# Altium schematic sheet LCD_Board.SchDoc
size A; SheetNumber: 2; SheetTotal: 2
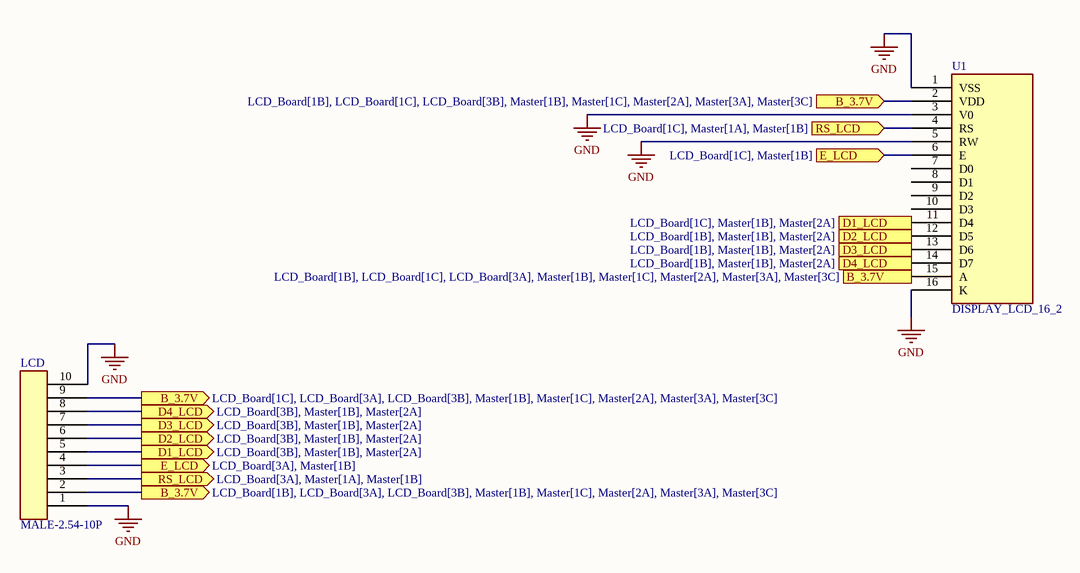
[diagram p0: LCD_Board.SchDoc]

## Parts
LCD  MALE-2.54-10P  [MALE-2.54-10P]
U1  DISPLAY_LCD_16_2  [DISPLAY_LCD_16_2]

## Ports
B_3.7V (in, see LCD_Board[1B], LCD_Board[1C], LCD_Board[3A], Master[1B], Master[1C], Master[2A], Master[3A], Master[3C]), B_3.7V (in, see LCD_Board[1B], LCD_Board[1C], LCD_Board[3B], Master[1B], Master[1C], Master[2A], Master[3A], Master[3C]), B_3.7V (out, see LCD_Board[1B], LCD_Board[3A], LCD_Board[3B], Master[1B], Master[1C], Master[2A], Master[3A], Master[3C]), B_3.7V (out, see LCD_Board[1C], LCD_Board[3A], LCD_Board[3B], Master[1B], Master[1C], Master[2A], Master[3A], Master[3C]), D1_LCD (in, see LCD_Board[1C], Master[1B], Master[2A]), D1_LCD (out, see LCD_Board[3B], Master[1B], Master[2A]), D2_LCD (in, see LCD_Board[1B], Master[1B], Master[2A]), D2_LCD (out, see LCD_Board[3B], Master[1B], Master[2A]), D3_LCD (in, see LCD_Board[1B], Master[1B], Master[2A]), D3_LCD (out, see LCD_Board[3B], Master[1B], Master[2A]), D4_LCD (in, see LCD_Board[1B], Master[1B], Master[2A]), D4_LCD (out, see LCD_Board[3B], Master[1B], Master[2A]), E_LCD (in, see LCD_Board[1C], Master[1B]), E_LCD (out, see LCD_Board[3A], Master[1B]), RS_LCD (in, see LCD_Board[1C], Master[1A], Master[1B]), RS_LCD (out, see LCD_Board[3A], Master[1A], Master[1B])

## Nets
GND: LCD.1 LCD.10 U1.1(VSS) U1.3(V0) U1.5(RW) U1.16(K)
B_3.7V: LCD.2 LCD.9 U1.2(VDD) U1.15(A) ; port B_3.7V
D1_LCD: LCD.5 U1.11(D4) ; port D1_LCD
D2_LCD: LCD.6 U1.12(D5) ; port D2_LCD
D3_LCD: LCD.7 U1.13(D6) ; port D3_LCD
D4_LCD: LCD.8 U1.14(D7) ; port D4_LCD
E_LCD: LCD.4 U1.6(E) ; port E_LCD
RS_LCD: LCD.3 U1.4(RS) ; port RS_LCD

Not connected (* = marked no-connect by the designer): U1 7(D0) 8(D1) 9(D2) 10(D3)

## Library data of the parts
LCD = MALE-2.54-10P: Male Header Connector 2.54mm 10 Pins.; JLCPCB PN: C492409
U1 = DISPLAY_LCD_16_2: Display LCD 16x2 I2C.